# Altium project Servo_Motor.PrjPcb
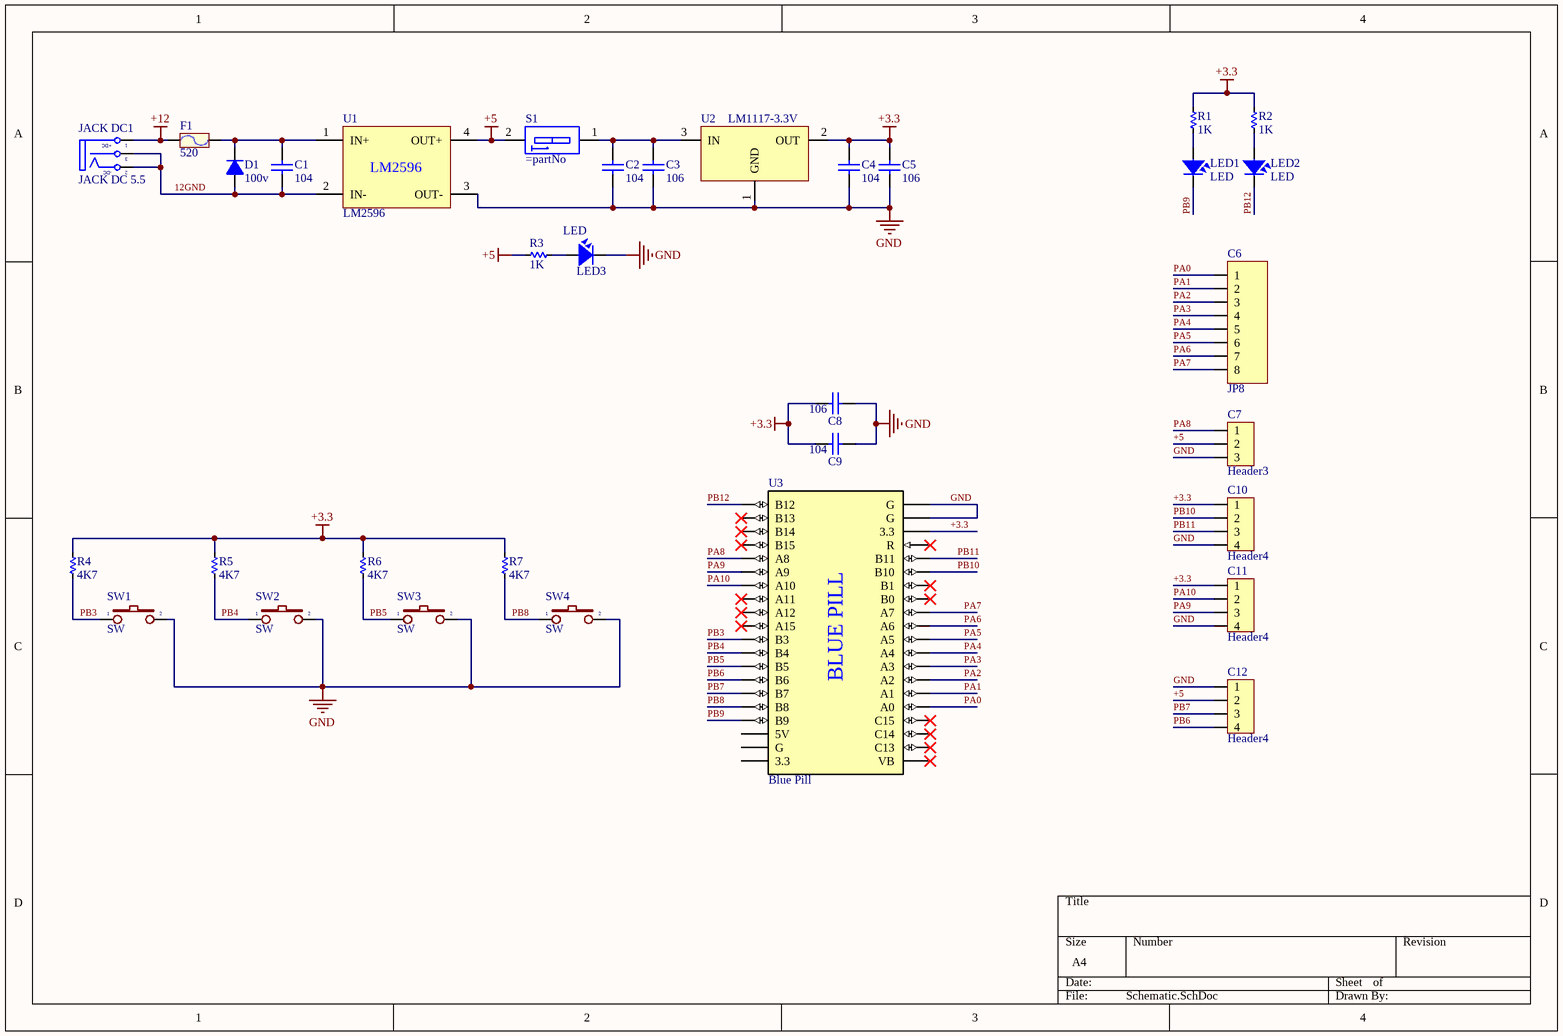
[diagram p0: Schematic.SchDoc]
1 sheet, 33 parts. Net scope: global (net labels, ports and power ports of the same name join across sheets).
Board file: PCB1.PcbDoc

## Sheet Schematic.SchDoc
size A4; SheetNumber: 1; SheetTotal: 1

### Parts
C1  104  [tu gom]
C2  104  [tu gom]
C3  106  [tu gom]
C4  104  [tu gom]
C5  106  [tu gom]
C6  JP8  [JP8-D1T]
C7  Header3  [Header3]
C8  106  [tu gom]
C9  104  [tu gom]
C10  Header4  [Header4]
C11  Header4  [Header4]
C12  Header4  [Header4]
D1  100v  [DIODE 1A]
F1  520  [De Cau Chi 520 630]
JACK_DC1  JACK DC 5.5  [JACK DC 5.5]
LED1  LED  [LED-3MM-YELLOW]
LED2  LED  [LED-3MM-YELLOW]
LED3  LED  [LED-3MM-YELLOW]
R1  1K  [RES-1/4W]
R2  1K  [RES-1/4W]
R3  1K  [RES-1/4W]
R4  4K7  [RES-1/4W]
R5  4K7  [RES-1/4W]
R6  4K7  [RES-1/4W]
R7  4K7  [RES-1/4W]
S1  (no value)  [SW-DIP1]
SW1  SW  [SW2]
SW2  SW  [SW2]
SW3  SW  [SW2]
SW4  SW  [SW2]
U1  LM2596  [LM2596 Module]
U2  LM1117-3.3V  [TO220-123]
U3  Blue Pill  [Blue Pill STM32F103]

### Nets
+3.3: C4.1 C5.1 C8.1 C9.1 C10.1 C11.1 R1.2 R2.2 R4.1 R5.1 R6.1 R7.1 U2.2(OUT) U3.38(3.3)
+5: C7.2 C12.2 R3.2 S1.2 U1.4(OUT+)
+12: F1.1 JACK_DC1.1(T)
GND: C2.2 C3.2 C4.2 C5.2 C7.3 C8.2 C9.2 C10.4 C11.4 C12.1 LED3.2 SW1.2 SW2.2 SW3.2 SW4.2 U1.3(OUT-) U2.1(GND) U3.39(G) U3.40(G)
12GND: C1.2 D1.1(A) JACK_DC1.2(TN) JACK_DC1.3(S) U1.2(IN-)
PA0: C6.1 U3.25(A0)
PA1: C6.2 U3.26(A1)
PA2: C6.3 U3.27(A2)
PA3: C6.4 U3.28(A3)
PA4: C6.5 U3.29(A4)
PA5: C6.6 U3.30(A5)
PA6: C6.7 U3.31(A6)
PA7: C6.8 U3.32(A7)
PA8: C7.1 U3.5(A8)
PA9: C11.3 U3.6(A9)
PA10: C11.2 U3.7(A10)
PB3: R4.2 SW1.1 U3.11(B3)
PB4: R5.2 SW2.1 U3.12(B4)
PB5: R6.2 SW3.1 U3.13(B5)
PB6: C12.4 U3.14(B6)
PB7: C12.3 U3.15(B7)
PB8: R7.2 SW4.1 U3.16(B8)
PB9: LED1.2 U3.17(B9)
PB10: C10.2 U3.35(B10)
PB11: C10.3 U3.36(B11)
PB12: LED2.2 U3.1(B12)
NetC1_1: C1.1 D1.2(K) F1.2 U1.1(IN+)
NetC2_1: C2.1 C3.1 S1.1 U2.3(IN)
NetLED1_1: LED1.1 R1.1
NetLED2_1: LED2.1 R2.1
NetLED3_1: LED3.1 R3.1

Not connected (* = marked no-connect by the designer): U3 2(B13)* 3(B14)* 4(B15)* 8(A11)* 9(A12)* 10(A15)* 18(5V) 19(G) 20(3.3) 21(VB)* 22(C13)* 23(C14)* 24(C15)* 33(B0)* 34(B1)* 37(R)*

### Notes on the sheet
- (in symbol Blue Pill STM32F103) BLUE PILL
- (in symbol JACK DC 5.5) +DC; -DC

### Library data of the parts
C1-C5 C8 C9 = Tu gom 104 50V: Cắm; So_Chan: 2; Ten_Linh_Kien: Tụ gốm 104 100nF 50V; Don_Vi: Con; Ma_Hang: MH004761; Chung_Loai: Cắm; Kieu_Chan: *
C6 = JP8: WR-PHD 2.54 mm Angled Socket Header; Manufacturer: W¨¹rth Elektronik eiSos GmbH; partNo: 613008143121; ComponentLink1 Description: Manufacturer; ComponentLink2 Description: Datasheet; NoPins: 08; Created Date: 29 March 2013; ComponentLink1URL: http://www.we-online.com; ComponentLink2URL: http://katalog.we-online.de/em/datasheet/6130xx143121.pdf; Created by: Karrer Zheng
C7 = Header3: Header IDC, 3 x 1 Pin Vertical 2.54mm Pitch (Non-Boxed, Male); Manufacturer: W¨¹rth Elektronik eiSos GmbH; partNo: 613002143121; ComponentLink1 Description: Manufacturer; ComponentLink2 Description: Datasheet; NoPins: 02; Created Date: 29 March 2013; ComponentLink1URL: http://www.we-online.com; ComponentLink2URL: http://katalog.we-online.de/em/datasheet/6130xx143121.pdf; Created by: Karrer Zheng
C10-C12 = Header4: Header IDC, 4 x 1 Pin Vertical 2.54mm Pitch (Non-Boxed, Male); Manufacturer: W¨¹rth Elektronik eiSos GmbH; partNo: 613002143121; ComponentLink1 Description: Manufacturer; ComponentLink2 Description: Datasheet; NoPins: 02; Created Date: 29 March 2013; ComponentLink1URL: http://www.we-online.com; ComponentLink2URL: http://katalog.we-online.de/em/datasheet/6130xx143121.pdf; Created by: Karrer Zheng
D1 = Diode 1N4007: Cắm; Ten_Linh_Kien: Diode 1N4007 1A (DIP); Don_Vi: Con; Ma_Hang: MH001063; Ghi Chu: *; Kieu_Chan: *; Chung_Loai: Cắm
F1 = De Cau Chi 520 630: 5x20mm; Ma_Hang: MH001473; Ten: Đế Cầu Chì 5x20MM 6x30MM SMD01
JACK_DC1 = JACK DC 5.5: Value: Jac DC
LED1-LED3 = LED: LED Single colour Green and Red; Value: LED 3 ly Single Colour
R1-R7 = Res: Manufacturer: Generic Components; Class: Passive; SubClass: R; Published: 08/06/2000; Publisher: Altium Hobart Technology Centre
S1 = SWDIP1: WS-DITV 2.54 mm small compact THT flat actuator with top tape; Manufacturer: Wurth Elektronik; Part No.: 418127160901; ComponentLink1 Description: Manufacturer; ComponentLink2 Description: Datasheet; Pole: 01; Created Date: Dec.2015; ComponentLink1URL: http://www.we-online.com; ComponentLink2URL: http://katalog.we-online.de/em/datasheet/4181271609xx.pdf; Created by: Baojun Chen
SW1-SW4 = SW2: Switch button 2 pin; Value: SW chip 2 pin
U1 = LM2596 Module: DC - DC Buck
U2 = LM1117: 800mA Low-Dropout Linear Regulator; Creator: Nguyen Ba Bien; Website: http://group3i.net
U3 = Blue Pill STM32F103: Blue Pill STM32F103C8T6